# EAGLE design arpie_control-tab (EAGLE 6.4)
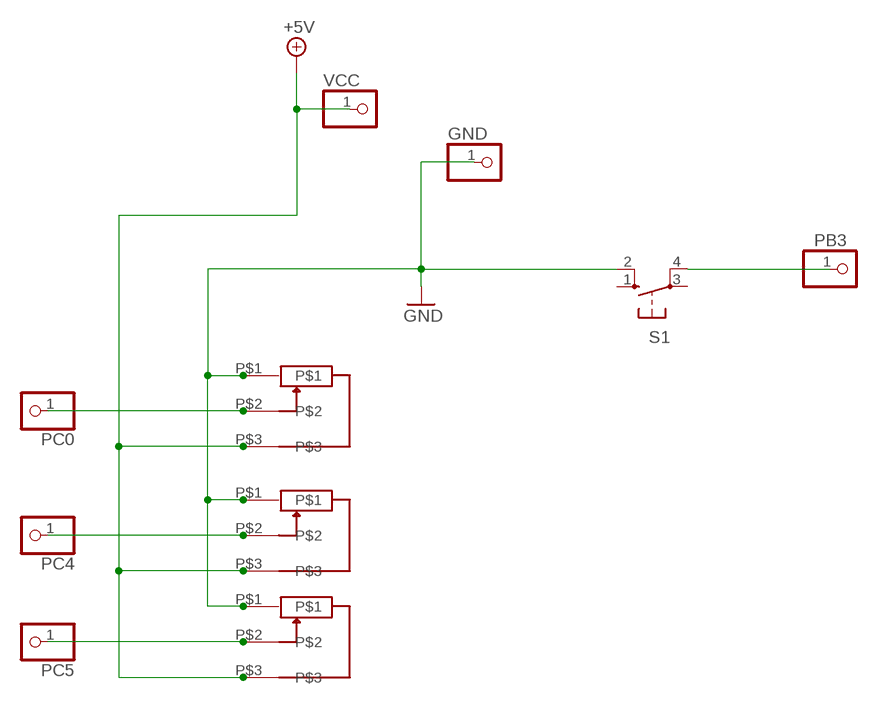
[diagram p0: schematic, sheet 1]

## Parts
GND  PINHD-1X1  [1X01]
PB3  PINHD-1X1  [1X01]
PC0  PINHD-1X1  [1X01]
PC4  PINHD-1X1  [1X01]
PC5  PINHD-1X1  [1X01]
S1  10-XX  [B3F-10XX]
U$1  PCBMOUNTPOT  [PCBMOUNTPOT]
U$2  PCBMOUNTPOT  [PCBMOUNTPOT]
U$3  PCBMOUNTPOT  [PCBMOUNTPOT]
VCC  PINHD-1X1  [1X01]

## Nets
+5V: U$1.P$3 U$2.P$3 U$3.P$3 VCC.1
GND: GND.1 S1.2(S1) U$1.P$1 U$2.P$1 U$3.P$1
N$1: PB3.1 S1.4(P1)
N$3: PC0.1 U$1.P$2
N$4: PC4.1 U$2.P$2
N$5: PC5.1 U$3.P$2
Unconnected: S1.1(S) S1.3(P)

## Library data of the parts
GND PB3 PC0 PC4 PC5 VCC = adafruit:PINHD-1X1: Pin header 1x1 for 0.1" spacing With round pins
S1 = switch-omron:10-XX: OMRON SWITCH
U$1-U$3 = jasons_stuff:PCBMOUNTPOT

## Board
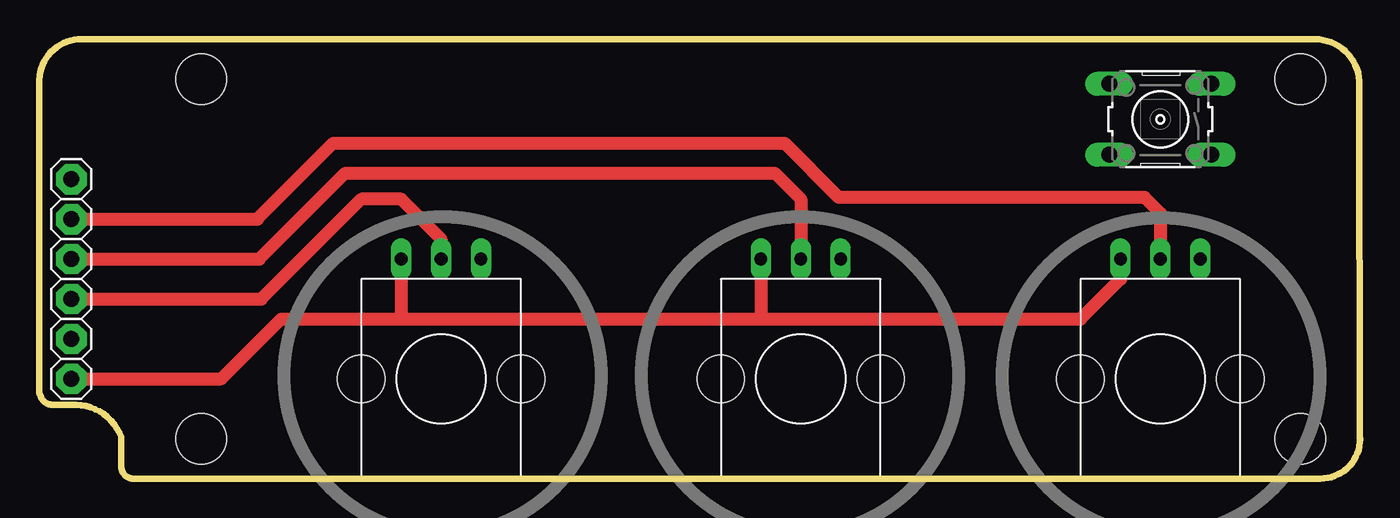
[diagram p1: board, top side]
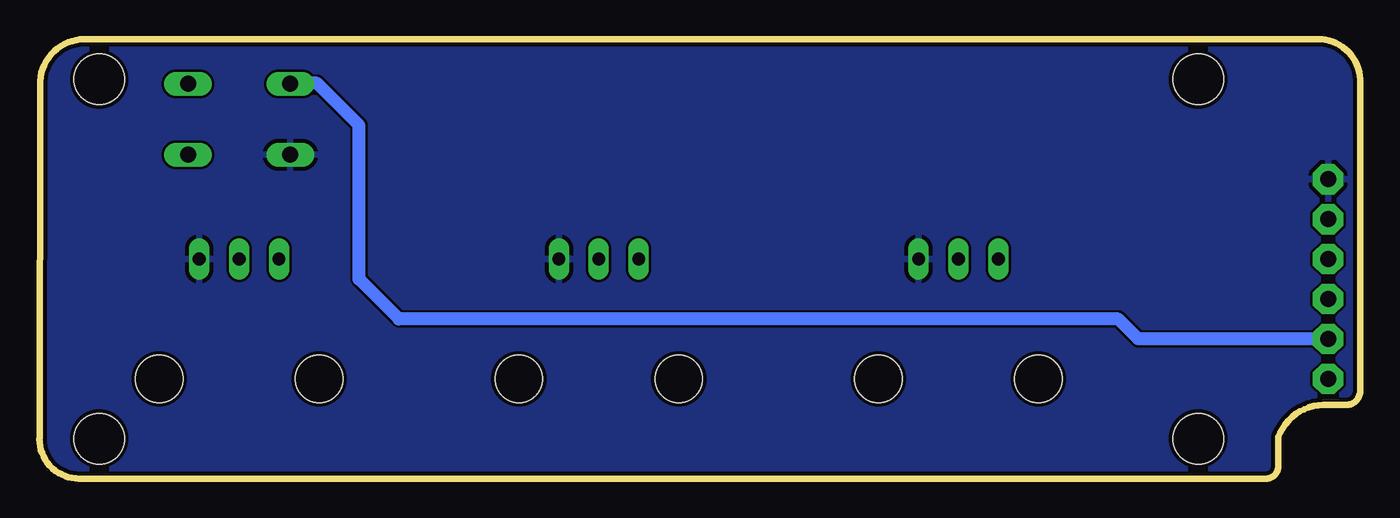
[diagram p2: board, bottom side, seen from below]

Size 83.96 x 27.95 mm. Coordinates in mm from the lower left corner, seen from the top.
Outline: 2.69,27.95 arc90 0.01,25.38 0.01,5.71 arc90 0.77,4.7 2.04,4.7 arc-72 5.22,2.67 5.22,0.76 arc90 5.98,0 81.42,0 arc90 83.96,2.54
Outline: 83.94,2.55 83.9,25.28 arc81 81.34,27.94 2.68,27.94
Copper layers (1*16): Top 0.035mm / dielectric 1.5mm / Bottom 0.035mm
Design rules "ITEADstudio_DRC": minimum track width 6mil, minimum drill 12mil, track to track 6mil, track to pad 6mil, pad to pad 6mil, via to via 6mil, smd to smd 0mil, copper to edge 10mil, drill to drill 10mil, minimum pad ring 10mil, minimum via ring 6mil, stop-mask expansion 2mil, vias tented up to drill 100mil, thermal gap 10mil
Holes 3.2 mm at 10.3,2.54 10.3,25.4 80.15,25.4 80.15,2.54

### Footprints (pad centres in the part's own frame; a part is rotated, then mirrored left to right if it is on the bottom)
1X01 = drill 1.016 pad 1.93 octagon: 1 0,0
B3F-10XX = drill 1.016 long: 1 -3.251,2.261; 2 3.251,2.261; 3 -3.251,-2.261; 4 3.251,-2.261
PCBMOUNTPOT = drill 0.8 long: P$1 -3.81,2.54; P$2 -3.81,0; P$3 -3.81,-2.54 | hole 3: 3.81,-5.08; 3.81,5.08

### Placement (x,y rotation side)
GND  2.04,19.05 0 top
PB3  2.04,8.89 0 top
PC0  2.04,11.43 0 top
PC4  2.04,13.97 0 top
PC5  2.04,16.51 0 top
S1  71.26,22.86 180 top
U$1  25.54,10.16 270 top
U$2  48.4,10.16 270 top
U$3  71.26,10.16 270 top
VCC  2.04,6.35 0 top

### Tracks (layer width: path | path; a pad name or v marks a point on that pad's centre or on a via)
+5V
  Top 0.813: VCC.1 11.57,6.35 15.38,10.16 23,10.16 | 23,10.16 45.86,10.16 | 45.86,10.16 66.18,10.16 68.72,12.7 U$3.P$3 | U$2.P$3 45.86,10.16 | U$1.P$3 23,10.16
GND
  pour Bottom: -1.69,29.16 -2,-1.22 85.07,-1.22 85.38,29.16
N$1
  Bottom 0.813: PB3.1 14.11,8.89 15.38,10.16 61.1,10.16 63.64,12.7 63.64,22.48 66.3,25.15 67.98,25.15 S1.4
N$3
  Top 0.813: PC0.1 14.11,11.43 20.46,17.78 23,17.78 25.54,15.24 U$1.P$2
N$4
  Top 0.813: PC4.1 13.98,13.97 19.44,19.43 46.74,19.43 48.4,17.78 U$2.P$2
N$5
  Top 0.813: PC5.1 13.85,16.51 18.68,21.34 47.38,21.34 50.81,17.91 70.24,17.91 71.26,16.89 U$3.P$2

### Text on the board
bDocu: controltab for arpie | rev 1 | hotchk155